# EAGLE design OpenBMS_Master_Shield (EAGLE 5.11)
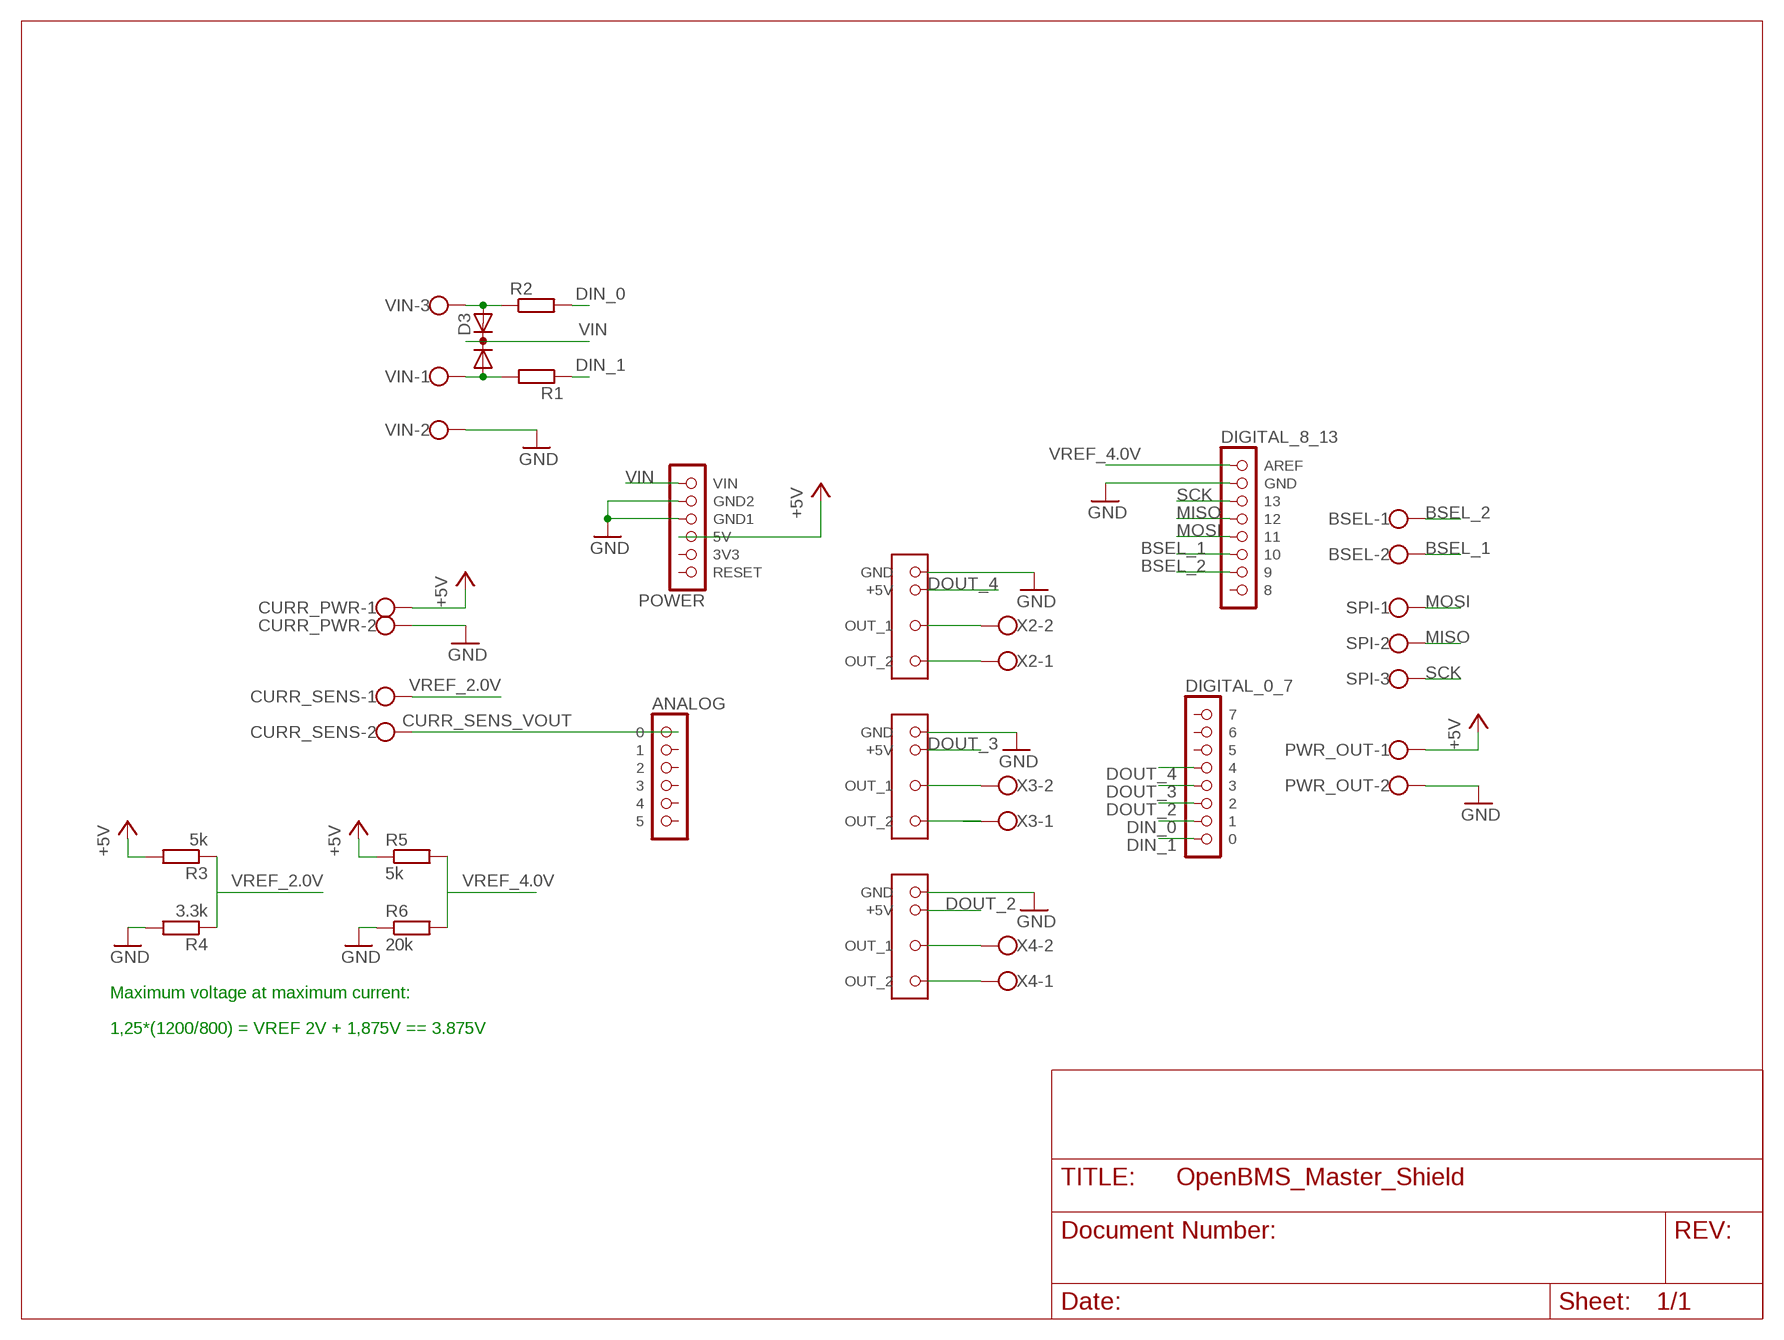
[diagram p0: schematic, sheet 1]

## Parts
BSEL  W237-102  [W237-102]
CURR_PWR  W237-102  [W237-102]
CURR_SENS  W237-102  [W237-102]
D3  DIODE_AC-CA_  [SOT23C]
PWR_OUT  W237-102  [W237-102]
R1  R-EU_R1206  [R1206]
R2  R-EU_R1206  [R1206]
R3  5k  R-EU_R1206  [R1206]
R4  3.3k  R-EU_R1206  [R1206]
R5  5k  R-EU_R1206  [R1206]
R6  20k  R-EU_R1206  [R1206]
SPI  W237-103  [W237-103]
SSRA  CPC1706  [CPC1706]
SSRB  CPC1706  [CPC1706]
SSRC  CPC1706  [CPC1706]
U$1  POWER  [1X06]
U$2  ANALOG  [1X06]
U$3  DIGITAL_0_7  [1X08]
U$4  DIGITAL_8_13  [1X08]
VIN  W237-103  [W237-103]
X2  W237-102  [W237-102]
X3  W237-102  [W237-102]
X4  W237-102  [W237-102]

## Nets
+5V: CURR_PWR.1 PWR_OUT.1 R3.2 R5.1 U$1.3(5V)
BSEL_1: BSEL.2 U$4.6
BSEL_2: BSEL.1 U$4.7
CURR_SENS_VOUT: CURR_SENS.2 U$2.1
DIN_0: R2.2 U$3.7
DIN_1: R1.1 U$3.8
DOUT_2: SSRA.+5V U$3.6
DOUT_3: SSRB.+5V U$3.5
DOUT_4: SSRC.+5V U$3.4
GND: CURR_PWR.2 PWR_OUT.2 R4.2 R6.1 SSRA.GND SSRB.GND SSRC.GND U$1.4(GND1) U$1.5(GND2) U$4.2(GND) VIN.2
MISO: SPI.2 U$4.4
MOSI: SPI.1 U$4.5
N$1: D3.2(A2) R2.1 VIN.3
N$2: D3.1(A1) R1.2 VIN.1
N$3: SSRC.OUT_1 X2.2
N$5: SSRC.OUT_2 X2.1
N$6: SSRA.OUT_2 X4.1
N$7: SSRA.OUT_1 X4.2
N$8: SSRB.OUT_2 X3.1
N$9: SSRB.OUT_1 X3.2
SCK: SPI.3 U$4.3
VIN: D3.3(K) U$1.6(VIN)
VREF_2.0V: CURR_SENS.1 R3.1 R4.1
VREF_4.0V: R5.2 R6.2 U$4.1(AREF)
Unconnected: U$1.1(RESET) U$1.2(3V3) U$2.2 U$2.3 U$2.4 U$2.5 U$2.6 U$3.1 U$3.2 U$3.3 U$4.8

## Notes on the sheet
- Maximum voltage at maximum current:
- 1,25*(1200/800) = VREF 2V + 1,875V == 3.875V

## Library data of the parts
BSEL CURR_PWR CURR_SENS PWR_OUT X2-X4 = con-wago-500:W237-102: WAGO SCREW CLAMP; MPN: 237-102; OC_FARNELL: unknown; OC_NEWARK: 70K9898
D3 = semicon-smd-ipc:DIODE_AC-CA_: DUAL DIODE
R1-R6 = resistor:R-EU_: RESISTOR, European symbol
SPI VIN = con-wago-500:W237-103: WAGO SCREW CLAMP; MPN: 237-103; OC_FARNELL: unknown; OC_NEWARK: 18M7116
SSRA SSRB SSRC = BMS:CPC1706: Single-Pole, Normally Open 4-Pin OptoMOS® DC Power SIP Relay by Clare
U$1 = arduino:POWER
U$2 = arduino:ANALOG
U$3 = arduino:DIGITAL_0_7
U$4 = arduino:DIGITAL_8_13

## Board
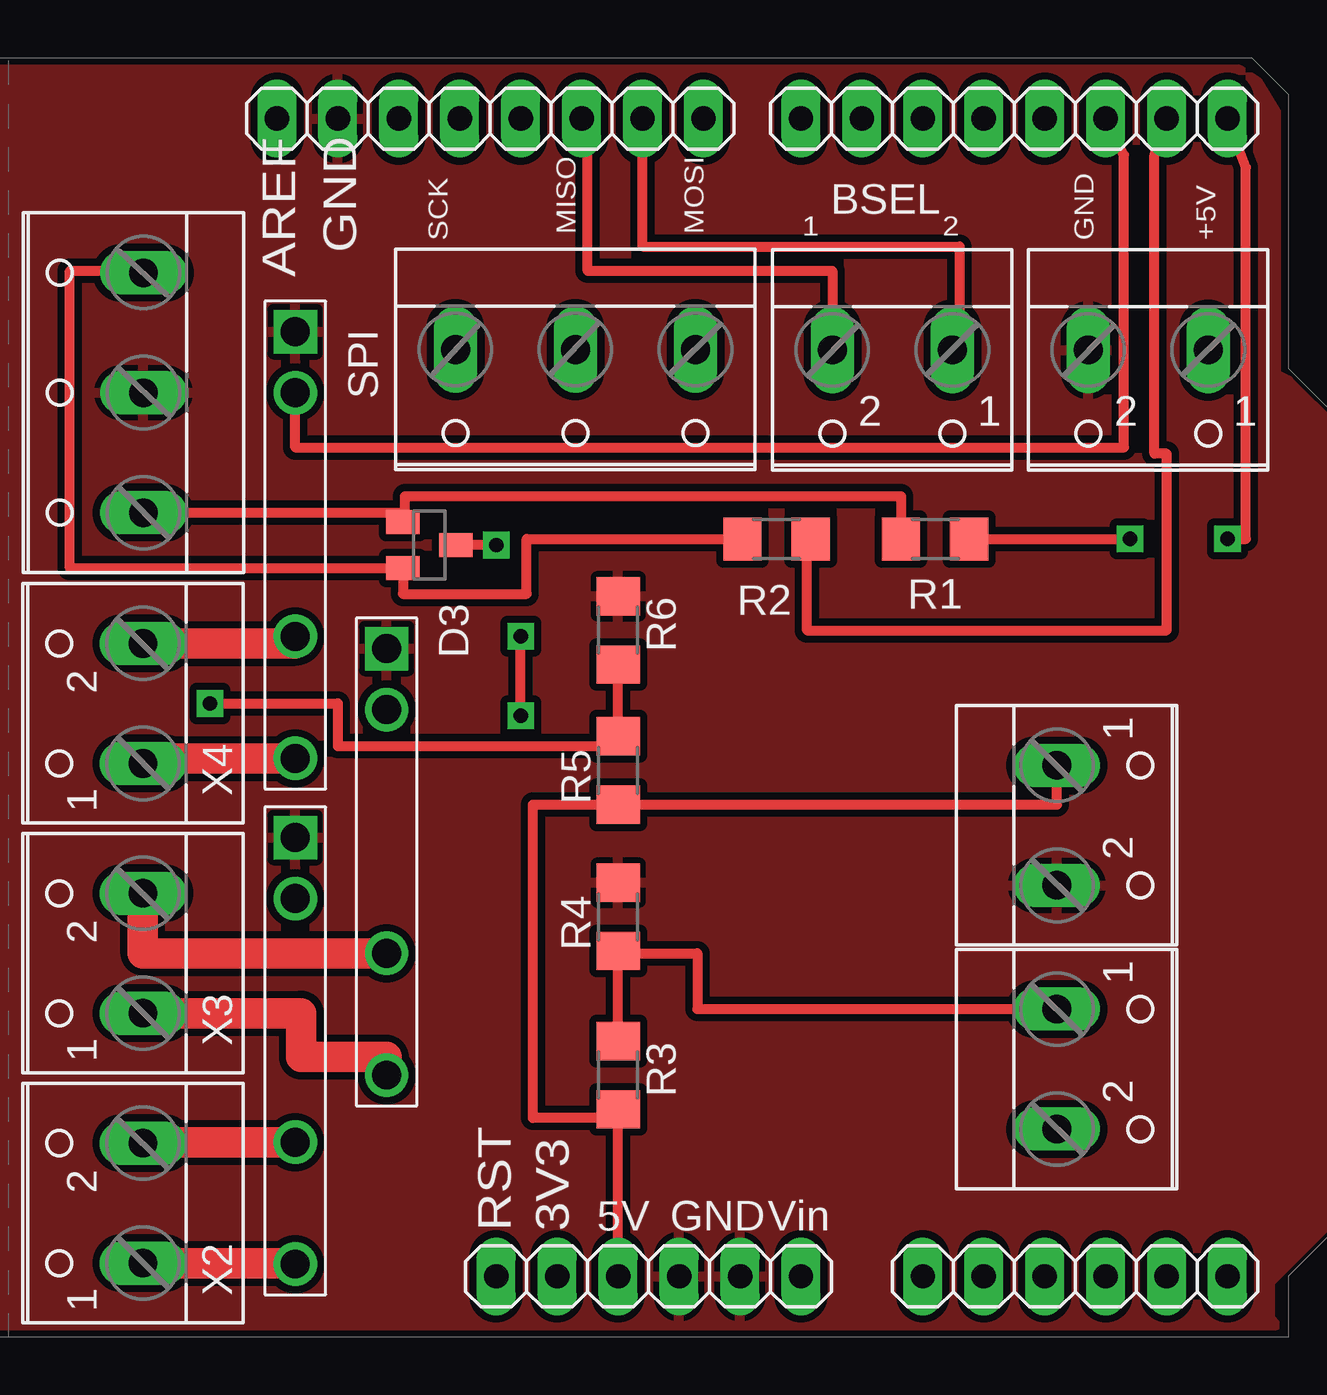
[diagram p1: board, top side]
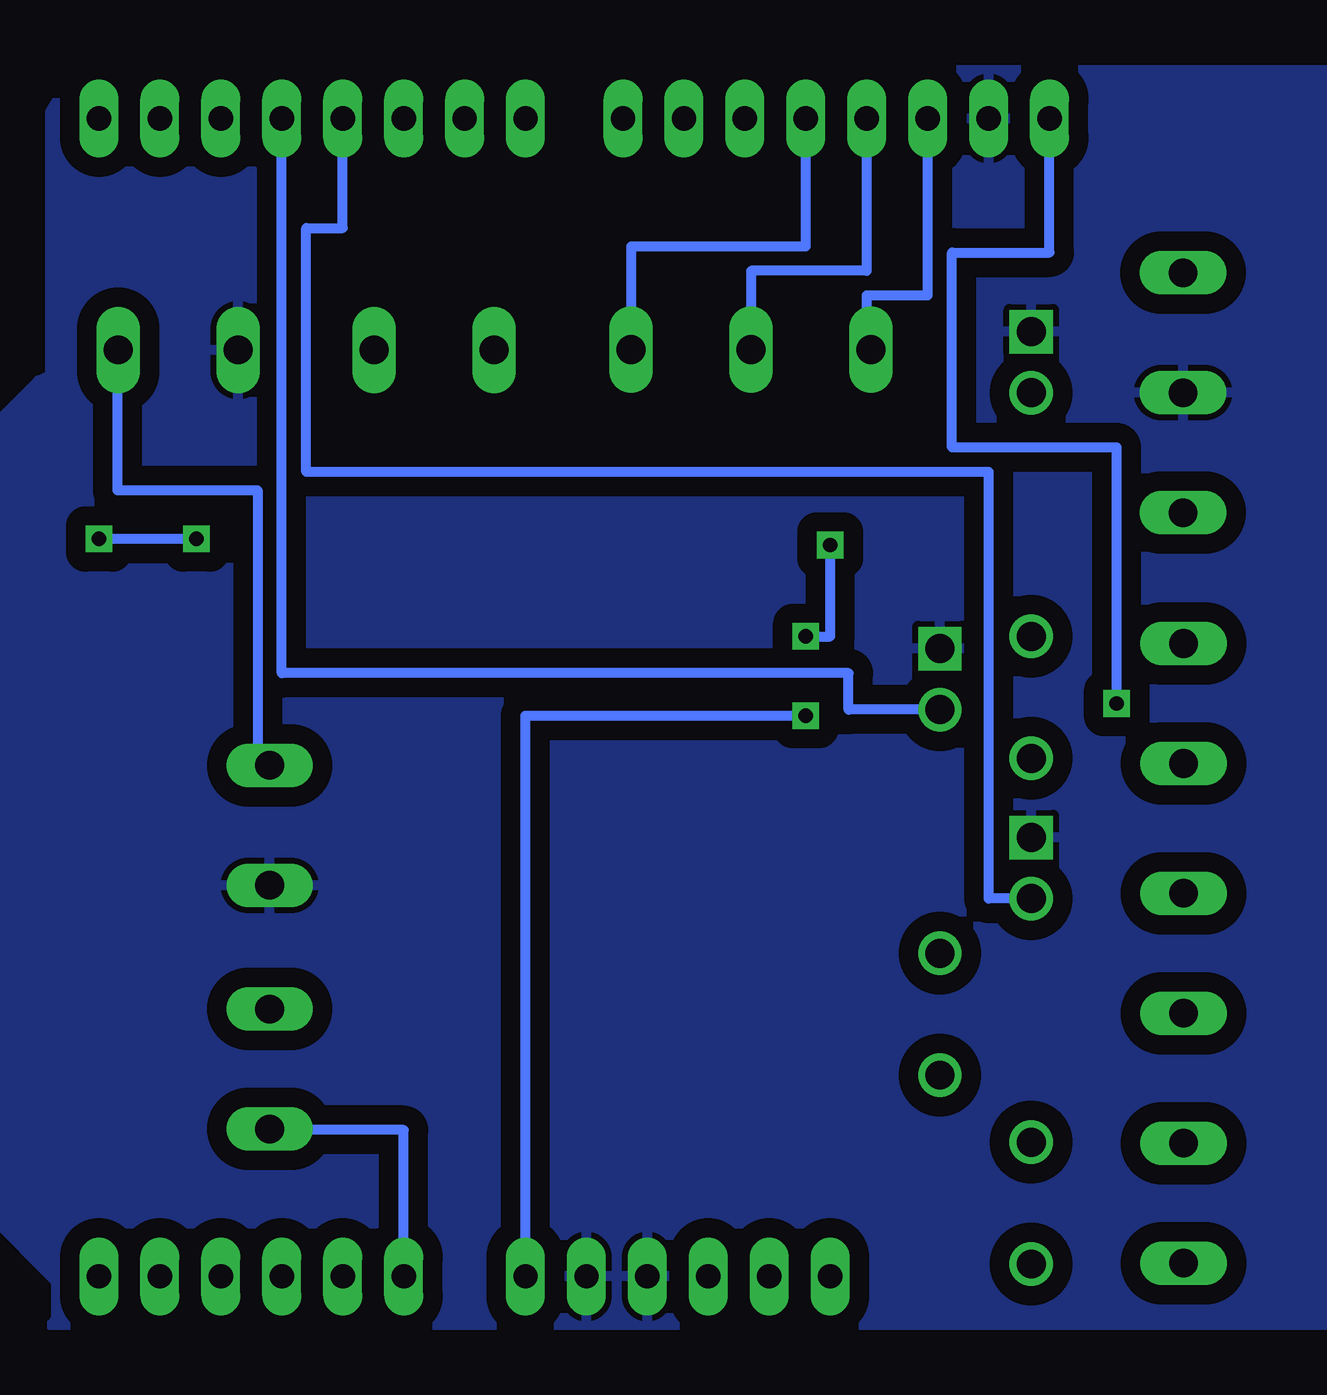
[diagram p2: board, bottom side, seen from below]

No outline drawn. Coordinates in mm, seen from the top.
Copper layers (1*16): Top 0.035mm / dielectric 1.5mm / Bottom 0.035mm
Design rules "SparkFun-BatchPCB": minimum track width 8mil, minimum drill 20mil, track to track 8mil, track to pad 8mil, pad to pad 8mil, via to via 8mil, smd to smd 8mil, copper to edge 10mil, drill to drill 8mil, minimum pad ring 12mil, minimum via ring 10mil, stop-mask expansion 4mil, vias tented up to drill 25mil, thermal gap 10mil

### Footprints (pad centres in the part's own frame; a part is rotated, then mirrored left to right if it is on the bottom)
W237-102 = drill 1.194 long: 1 -2.5,-1.27; 2 2.5,-1.27
SOT23C = smd 1 x 1.4: 1 -0.95,-1.1; 2 0.95,-1.1; 3 0,1.1
R1206 = smd 1.6 x 1.803: 1 -1.422,0; 2 1.422,0
W237-103 = drill 1.194 long: 1 -5,-1.29; 2 0,-1.29; 3 5,-1.29
CPC1706 = drill 1.2 round: +5V 0,0; OUT_1 10.16,0; OUT_2 15.24,0 | drill 1.2 square: GND -2.54,0
1X06 = drill 1.016 long: 1 -6.35,0; 2 -3.81,0; 3 -1.27,0; 4 1.27,0; 5 3.81,0; 6 6.35,0
1X08 = drill 1.016 long: 1 -8.89,0; 2 -6.35,0; 3 -3.81,0; 4 -1.27,0; 5 1.27,0; 6 3.81,0; 7 6.35,0; 8 8.89,0

### Placement (x,y rotation side)
BSEL  49.53,39.88 180 top
CURR_PWR  57.66,21.34 270 top
CURR_SENS  57.66,11.18 270 top
D3  30.23,33.02 270 top
PWR_OUT  60.2,39.88 180 top
R1  51.31,33.27 180 top
R2  44.7,33.27 0 top
R3  38.1,10.92 270 top
R4  38.1,17.53 90 top
R5  38.1,23.62 90 top
R6  38.1,29.46 270 top
SPI  36.32,39.88 180 top
SSRA  24.64,39.37 270 top
SSRB  28.45,26.16 270 top
SSRC  24.64,18.29 270 top
U$1  39.37,2.54 0 top
U$2  57.15,2.54 0 top
U$3  54.61,50.8 0 top
U$4  32.77,50.8 0 top
VIN  17.02,39.37 90 top
X2  17.02,5.59 90 top
X3  17.02,16 90 top
X4  17.02,26.42 90 top

### Tracks (layer width: path | path; a pad name or v marks a point on that pad's centre or on a via)
+5V
  Top 0.406: CURR_PWR.1 56.39,22.2 R5.1 34.54,22.2 34.54,9.14 38.1,9.14 R3.2 U$1.3
  Bottom 0.406: PWR_OUT.1 62.74,41.15 62.74,35.31 56.9,35.31 56.9,23.88 56.39,23.88 CURR_PWR.1
BSEL_1
  Top 0.406: U$4.6 36.83,50.8 36.83,44.45 47.03,44.45 BSEL.2
BSEL_2
  Top 0.406: BSEL.1 52.32,41.15 52.32,45.47 39.12,45.47 U$4.7
CURR_SENS_VOUT
  Bottom 0.406: U$2.1 50.8,8.64 56.39,8.64 CURR_SENS.2
DIN_0
  Top 0.406: R2.2 45.97,33.27 45.97,29.46 60.96,29.46 60.96,36.83 60.45,36.83 60.45,49.28 U$3.7
DIN_1  (via drill 0.6)
  Top 0.406: R1.1 v59.44,33.27 | v63.5,33.27 64.26,33.27 64.26,48.77 U$3.8
  Bottom 0.406: v59.44,33.27 v63.5,33.27
DOUT_2
  Top 0.406: SSRA.+5V 24.64,37.08 59.18,37.08 59.18,49.28 U$3.6
DOUT_3
  Bottom 0.406: U$3.5 55.88,27.69 32.26,27.69 32.26,26.16 SSRB.+5V
DOUT_4
  Bottom 0.406: U$3.4 53.34,46.23 54.86,46.23 54.86,36.07 26.42,36.07 26.42,18.29 SSRC.+5V
GND
  pour Top (isolate 0.305): 64.01,52.83 0.51,52.83 0.51,0.51 65.53,0.51 65.28,0.76 65.28,2.29 68.07,5.08 68.33,5.08 68.07,37.85 66.04,39.88 65.53,40.13 65.53,51.05 64.77,52.32
  pour Bottom (isolate 0.813): 64.01,52.83 0.51,52.83 0.51,0.51 65.53,0.51 65.28,0.76 65.28,2.29 68.07,5.08 68.33,5.08 68.07,37.85 66.04,39.88 65.53,40.13 65.53,51.05 64.77,52.32
MISO
  Bottom 0.406: U$4.4 31.5,44.45 36.32,44.45 SPI.2
MOSI
  Bottom 0.406: U$4.5 34.04,45.47 41.32,45.47 SPI.1
N$1
  Top 0.406: R2.1 34.29,33.27 34.29,30.99 29.13,30.99 D3.2 15.24,32.07 15.24,44.45 18.31,44.45 VIN.3
N$2
  Top 0.406: VIN.1 29.13,34.37 D3.1 29.21,33.97 29.21,35.05 49.89,35.05 R1.2
N$3
  Top 1.27: SSRC.OUT_1 18.29,8.13 X2.2
N$5
  Top 1.27: X2.1 24.64,3.09 SSRC.OUT_2
N$6
  Top 1.27: SSRA.OUT_2 18.29,24.13 X4.1
N$7
  Top 1.27: X4.2 24.64,28.92 SSRA.OUT_1
N$8
  Top 1.27: X3.1 24.89,13.5 24.89,11.68 28.45,11.68 SSRB.OUT_2
N$9
  Top 1.27: SSRB.OUT_1 18.29,16 X3.2
SCK
  Bottom 0.406: SPI.3 31.5,41.17 31.5,43.43 28.96,43.43 U$4.3
VIN  (via drill 0.6)
  Top 0.406: v33.02,33.02 D3.3 | v34.04,25.91 v34.04,29.21
  Bottom 0.406: U$1.6 45.72,25.91 v34.04,25.91 | v33.02,33.02 33.02,29.21 v34.04,29.21
VREF_2.0V
  Top 0.406: CURR_SENS.1 41.4,13.68 41.4,16 38.1,16 R4.1 R3.1
VREF_4.0V  (via drill 0.6)
  Top 0.406: R6.2 R5.2 38.1,24.64 26.42,24.64 26.42,26.42 v21.08,26.42
  Bottom 0.406: U$4.1 23.88,45.21 27.94,45.21 27.94,37.08 21.08,37.08 v21.08,26.42

### Text on the board
tNames: 1 | 2 | SCK | MISO | MOSI | GND | +5V | GND | AREF | RST | 3V3 | 5V | GND | Vin
Document: +12V DC/DC | GND | +12V WALL | SSRA | +5V | GND | SSRB | VREF | CURRENT SENSOR | SIG | SSRC | OpenBMS Master Shield v. 0.1 | Henry Palonen 2012 | OpenBMS_Master_Shield.brd
TallParts: USB | ISP | PWR
ArduinoHoles: 3.2mm | 2.2mm | 3.2mm